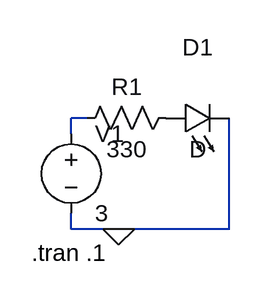
[diagram p0: schematic Indicateur_Niveau.asc]
Indicateur_Niveau.asc, the LTspice schematic file:
Version 4
SHEET 1 880 680
WIRE 176 128 160 128
WIRE 160 144 160 128
WIRE 160 240 160 224
WIRE 208 240 160 240
WIRE 320 240 320 128
WIRE 320 240 208 240
FLAG 208 240 0
SYMBOL LED 256 144 R270
WINDOW 0 72 32 VTop 2
WINDOW 3 0 32 VBottom 2
SYMATTR InstName D1
SYMBOL voltage 160 128 R0
WINDOW 123 0 0 Left 0
WINDOW 39 0 0 Left 0
SYMATTR InstName V1
SYMATTR Value 3
SYMBOL res 272 112 R90
WINDOW 0 0 56 VBottom 2
WINDOW 3 32 56 VTop 2
SYMATTR InstName R1
SYMATTR Value 330
TEXT 120 264 Left 2 !.tran .1

The netlist it stands for:
* Indicateur_Niveau.asc
D1 P001 0 D
V1 N001 0 3
R1 P001 N001 330
.model D D
.lib standard.dio
.tran .1
.backanno
.end